# Altium schematic sheet Bus Extender.SchDoc
size A4; SheetNumber: 5; SheetTotal: 5
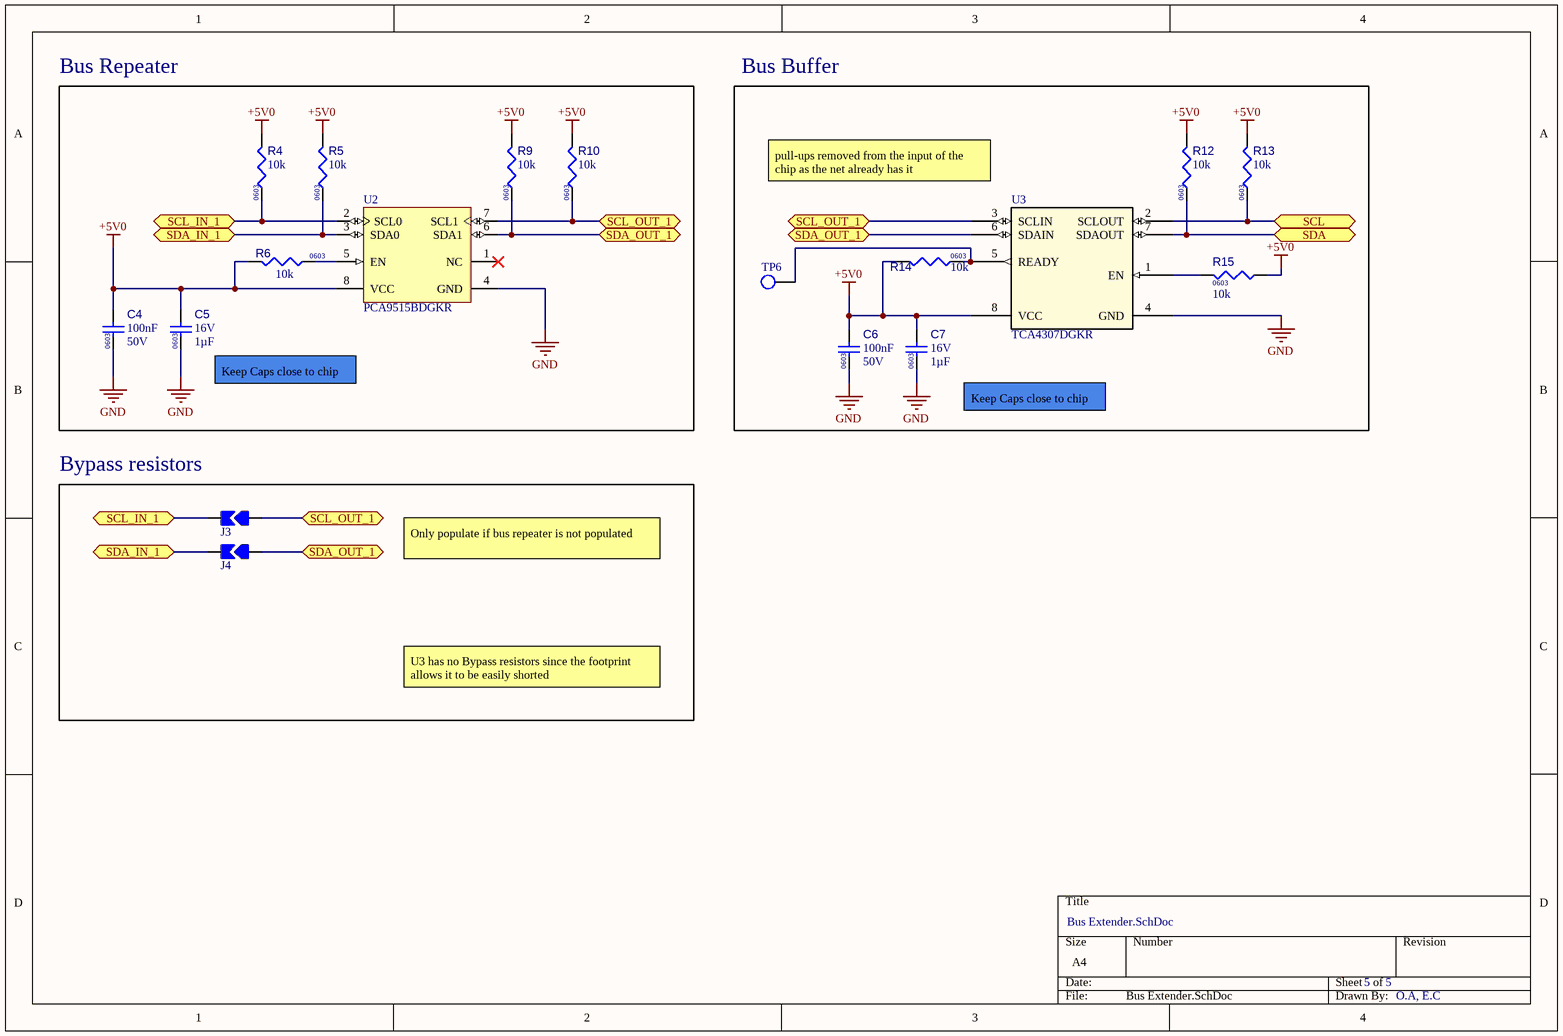
[diagram p0: Bus Extender.SchDoc]

## Parts
C4  value 100nF  Voltage Rating: 50V  Case/Package: 0603  [CAPC1608X90X40NL10T20]  (hidden comment: Capacitor 100 nF +/-10% 50 V 0603)
C5  value 1µF  Case/Package: 0603  Voltage Rating: 16V  [CAPC1608X90X35NL15T15]  (hidden comment: Capacitor 1uF +/- 10% 16V 0603)
C6  value 100nF  Voltage Rating: 50V  Case/Package: 0603  [CAPC1608X90X40NL10T20]  (hidden comment: Capacitor 100 nF +/-10% 50 V 0603)
C7  value 1µF  Case/Package: 0603  Voltage Rating: 16V  [CAPC1608X90X35NL15T15]  (hidden comment: Capacitor 1uF +/- 10% 16V 0603)
J3  Solder jumper  [New footprint 1]  (value not drawn)
J4  Solder jumper  [New footprint 1]  (value not drawn)
R4  value 10k  Case/Package: 0603  [RESC1608X55X25NL10T15]  (hidden comment: Resistor 10k +/-1% 0603 100 mW)
R5  value 10k  Case/Package: 0603  [RESC1608X55X25NL10T15]  (hidden comment: Resistor 10k +/-1% 0603 100 mW)
R6  value 10k  Case/Package: 0603  [RESC1608X55X25NL10T15]  (hidden comment: Resistor 10k +/-1% 0603 100 mW)
R9  value 10k  Case/Package: 0603  [RESC1608X55X25NL10T15]  (hidden comment: Resistor 10k +/-1% 0603 100 mW)
R10  value 10k  Case/Package: 0603  [RESC1608X55X25NL10T15]  (hidden comment: Resistor 10k +/-1% 0603 100 mW)
R12  value 10k  Case/Package: 0603  [RESC1608X55X25NL10T15]  (hidden comment: Resistor 10k +/-1% 0603 100 mW)
R13  value 10k  Case/Package: 0603  [RESC1608X55X25NL10T15]  (hidden comment: Resistor 10k +/-1% 0603 100 mW)
R14  value 10k  Case/Package: 0603  [RESC1608X55X25NL10T15]  (hidden comment: Resistor 10k +/-1% 0603 100 mW)
R15  value 10k  Case/Package: 0603  [RESC1608X55X25NL10T15]  (hidden comment: Resistor 10k +/-1% 0603 100 mW)
TP6  RCUCTE  [FP-S2761-46R-MFG]  (value not drawn)
U2  PCA9515BDGKR  [DGK0008A_L]
U3  TCA4307DGKR  [TCA4307DGKR-Footprint-1]

## Blocks framed on the sheet
Bus Repeater: C4 C5 R4-R6 R9 R10 U2
Bus Buffer: C6 C7 R12-R15 TP6 U3
Bypass resistors: J3 J4

## Ports
SCL (bidir), SCL_IN_1 (bidir), SCL_OUT_1 (bidir), SDA (bidir), SDA_IN_1 (bidir), SDA_OUT_1 (bidir)

## Nets
+5V0: C4.2 C5.2 C6.2 C7.2 R4.2 R5.2 R6.2 R9.2 R10.2 R12.2 R13.2 R14.2 R15.1 U2.8(VCC) U3.8(VCC)
GND: C4.1 C5.1 C6.1 C7.1 U2.4(GND) U3.4(GND)
SCL: R13.1 U3.2(SCLOUT) ; port SCL
SCL_IN_1: J3.2 R4.1 U2.2(SCL0) ; port SCL_IN_1
SCL_OUT_1: J3.1 R10.1 U2.7(SCL1) U3.3(SCLIN) ; port SCL_OUT_1
SDA: R12.1 U3.7(SDAOUT) ; port SDA
SDA_IN_1: J4.2 R5.1 U2.3(SDA0) ; port SDA_IN_1
SDA_OUT_1: J4.1 R9.1 U2.6(SDA1) U3.6(SDAIN) ; port SDA_OUT_1
NetR6_1: R6.1 U2.5(EN)
NetR14_1: R14.1 TP6.1 U3.5(READY)
NetR15_2: R15.2 U3.1(EN)

Not connected (* = marked no-connect by the designer): U2 1(NC)*

## Notes on the sheet
- (near U3) pull-ups removed from the input of the chip as the net already has it
- (near C5) Keep Caps close to chip
- Keep Caps close to chip
- Only populate if bus repeater is not populated
- U3 has no Bypass resistors since the footprint allows it to be easily shorted
- O.A, E.C

## Library data of the parts
C4 C6 = CMP-001-00017-8: Chip Capacitor, 100 nF, +/- 10%, 50 V, 0603 (1608 Metric); Capacitor Type: Ceramic; Tolerance: 10%; Mounting Technology: SM; Max Operating Temperature: 125°C; RoHS Compliant: True; Pins: 2; Min Operating Temperature: -55°C
C5 C7 = CMP-001-00004-8: Chip Capacitor, 1 uF, +/- 10%, 16 V, 0603 (1608 Metric); Capacitor Type: Ceramic; Mounting Technology: SM; RoHS Compliant: True; Min Operating Temperature: -55°C; Pins: 2; Max Operating Temperature: 125°C; Tolerance: 10%
J3 J4 = CMP-00030-00001-3
R4-R6 R9 R10 R12-R15 = CMP-009-00017-7: Chip Resistor, 10 KOhm, +/- 1%, 01 W, -55 to 155 degC, 0603 (1608 Metric); Voltage Rating: 50V; Power: 100mW; RoHS Compliant: True; Min Operating Temperature: -55°C; Pins: 2; Mounting Technology: SM; Max Operating Temperature: 155°C; Tolerance: 1%
TP6 = CMP-002-00072-5: Test point; Connector Type: Interconnection Device; Pins: 2; Max Operating Temperature: 125°C; Case/Package: 0603; Mounting Technology: Surface Mount; RoHS Compliant: Yes; Min Operating Temperature: -55°C
U2 = CMP-015-00014-2: Interface Circuit, BICMOS, PDSO8; Power Supplies: 2.5/3.3V; Package Body Material: Plastic; Min Supply Voltage: 2.3V; Nominal Supply Voltage: 2.5V; Channels: 1; Package Equivalence Code: TSSOP8,.19; Max Supply Voltage: 3.6V; Qualification Status: Not Qualified; Terminal Position: DUAL; Terminal Pitch: 0.65mm; Terminal Finish: Nickel; JESD-30 Code: S-PDSO-G8; RoHS Compliant: Yes; Surface Mount: Yes; Pins: 8; JESD-609 Code: e4; Height - Seated (Max): 1.1mm; Peak Reflow Temperature (Cel): 260°C; Package Style: SMALL OUTLINE, THIN PROFILE, SHRINK PITCHMeter; Interface IC Type: INTERFACE CIRCUIT; Min Operating Temperature: -40°C; Case/Package: TSSOP; Width: 3mm; Terminal Form: Gull Wing; Reach SVHC Compliant: Yes; Technology: BICMOS; Package Shape: Square; Temperature Grade: INDUSTRIAL; Moisture Sensitivity Level: 1; Max Operating Temperature: 85°C; Length: 3mm
U3 = CMP-015-00015-2: Interface Circuit, PDSO8